# EAGLE design pstage (EAGLE 5.06)
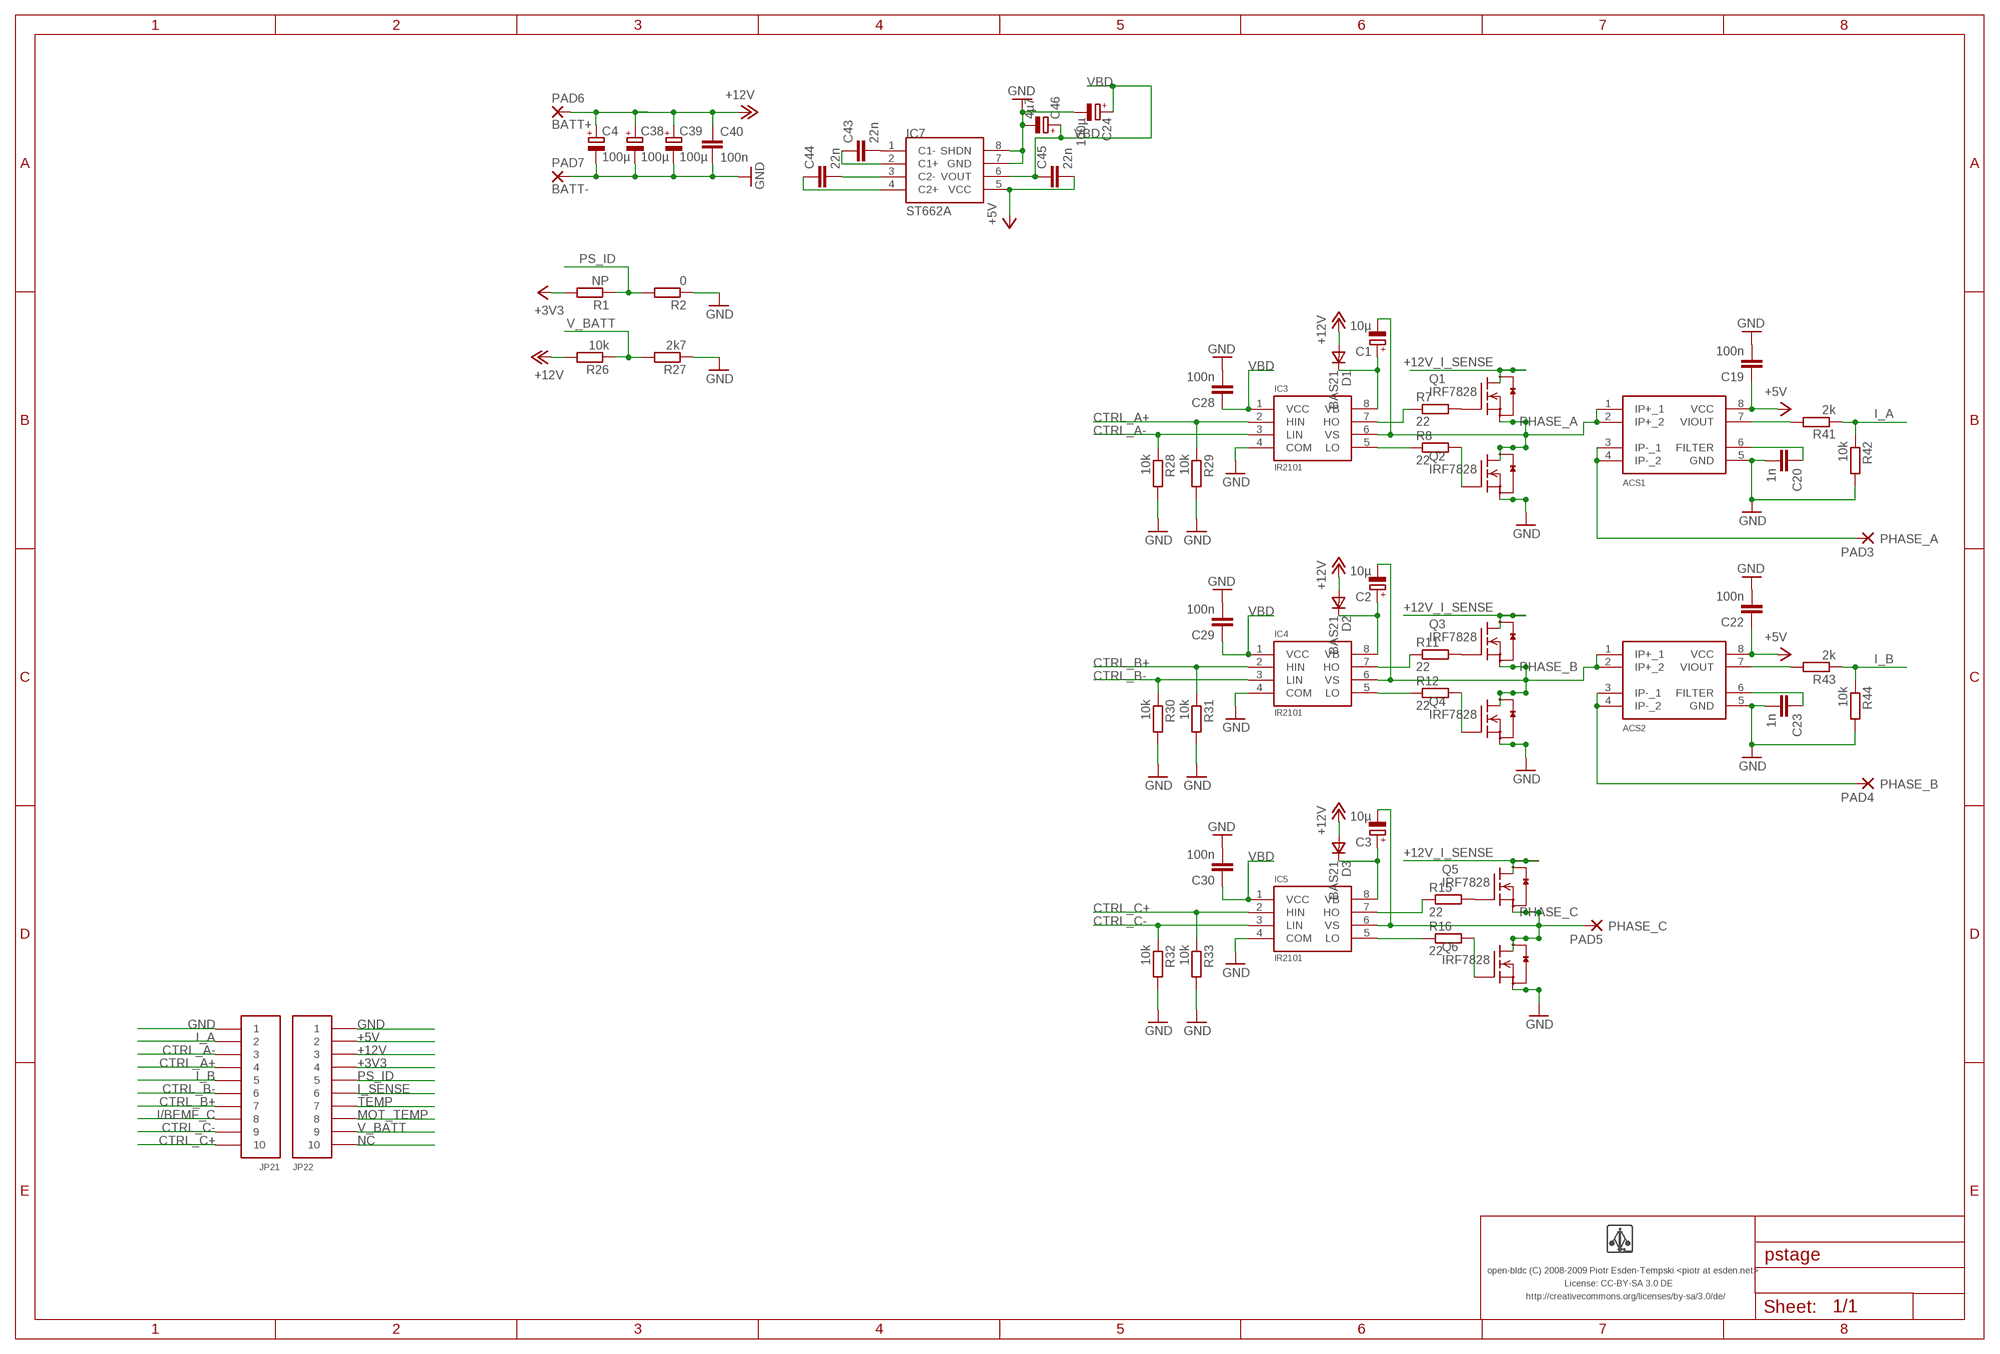
[diagram p0: schematic, sheet 1]

## Parts
ACS1  ACS712  [SO8]
ACS2  ACS712  [SO8]
C1  10µ  CPOL-EUA/3216-18R  [A/3216-18R]
C2  10µ  CPOL-EUA/3216-18R  [A/3216-18R]
C3  10µ  CPOL-EUA/3216-18R  [A/3216-18R]
C4  100µ  CPOL-EUD/7343-31R  [D/7343-31R]
C19  100n  C-EUC0603  [C0603]
C20  1n  C-EUC0603  [C0603]
C22  100n  C-EUC0603  [C0603]
C23  1n  C-EUC0603  [C0603]
C24  100µ  CPOL-EUD/7343-31R  [D/7343-31R]
C28  100n  C-EUC0603  [C0603]
C29  100n  C-EUC0603  [C0603]
C30  100n  C-EUC0603  [C0603]
C38  100µ  CPOL-EUD/7343-31R  [D/7343-31R]
C39  100µ  CPOL-EUD/7343-31R  [D/7343-31R]
C40  100n  C-EUC0603  [C0603]
C43  22n  C-EUC0603  [C0603]
C44  22n  C-EUC0603  [C0603]
C45  22n  C-EUC0603  [C0603]
C46  4µ7  CPOL-EUA/3216-18R  [A/3216-18R]
D1  BAS21  VAR2SOT23  [SOT-23]
D2  BAS21  VAR2SOT23  [SOT-23]
D3  BAS21  VAR2SOT23  [SOT-23]
IC3  IR2101  [SO-8]
IC4  IR2101  [SO-8]
IC5  IR2101  [SO-8]
IC7  ST662A  [SO8]
JP21  PIN_HDR_1.27MM_10  PIN_HDR_1.27MM_10_TH  [PIN_HDR_1.27MM_10]
JP22  PIN_HDR_1.27MM_10  PIN_HDR_1.27MM_10_TH  [PIN_HDR_1.27MM_10]
PAD3  PHASE_A  SMD5  [SMD2,54-5,08]
PAD4  PHASE_B  SMD5  [SMD2,54-5,08]
PAD5  PHASE_C  SMD5  [SMD2,54-5,08]
PAD6  BATT+  SMD5  [SMD2,54-5,08]
PAD7  BATT-  SMD5  [SMD2,54-5,08]
Q1  IRF7828  [SO8]
Q2  IRF7828  [SO8]
Q3  IRF7828  [SO8]
Q4  IRF7828  [SO8]
Q5  IRF7828  [SO8]
Q6  IRF7828  [SO8]
R1  NP  R-EU_R0603  [R0603]
R2  0  R-EU_R0603  [R0603]
R7  22  R-EU_R0603  [R0603]
R8  22  R-EU_R0603  [R0603]
R11  22  R-EU_R0603  [R0603]
R12  22  R-EU_R0603  [R0603]
R15  22  R-EU_R0603  [R0603]
R16  22  R-EU_R0603  [R0603]
R26  10k  R-EU_R0603  [R0603]
R27  2k7  R-EU_R0603  [R0603]
R28  10k  R-EU_R0603  [R0603]
R29  10k  R-EU_R0603  [R0603]
R30  10k  R-EU_R0603  [R0603]
R31  10k  R-EU_R0603  [R0603]
R32  10k  R-EU_R0603  [R0603]
R33  10k  R-EU_R0603  [R0603]
R41  2k  R-EU_R0603  [R0603]
R42  10k  R-EU_R0603  [R0603]
R43  2k  R-EU_R0603  [R0603]
R44  10k  R-EU_R0603  [R0603]
U$1  LOGO  [LOGO]

## Nets
+3V3: JP22.P$4 R1.2
+5V: ACS1.8(VCC) ACS2.8(VCC) C19.1 C22.1 C45.2 IC7.5(VCC) JP22.P$2
+12V: C4.+ C38.+ C39.+ C40.1 D1.3(A) D2.3(A) D3.3(A) JP22.P$3 PAD6.1(P) R26.2
+12V_I_SENSE: Q1.5(D1) Q1.6(D2) Q1.7(D3) Q1.8(D4) Q3.5(D1) Q3.6(D2) Q3.7(D3) Q3.8(D4) Q5.5(D1) Q5.6(D2) Q5.7(D3) Q5.8(D4)
CTRL_A+: IC3.2(HIN) JP21.P$4 R29.1
CTRL_A-: IC3.3(LIN) JP21.P$3 R28.1
CTRL_B+: IC4.2(HIN) JP21.P$7 R31.1
CTRL_B-: IC4.3(LIN) JP21.P$6 R30.1
CTRL_C+: IC5.2(HIN) JP21.P$10 R33.1
CTRL_C-: IC5.3(LIN) JP21.P$9 R32.1
GND: ACS1.5(GND) ACS2.5(GND) C4.- C19.2 C20.2 C22.2 C23.2 C24.- C28.2 C29.2 C30.2 C38.- C39.- C40.2 C46.- IC3.4(COM) IC4.4(COM) IC5.4(COM) IC7.7(GND) IC7.8(SHDN) JP21.P$1 JP22.P$1 PAD7.1(P) Q2.1(S3) Q2.2(S2) Q2.3(S1) Q4.1(S3) Q4.2(S2) Q4.3(S1) Q6.1(S3) Q6.2(S2) Q6.3(S1) R2.1 R27.1 R28.2 R29.2 R30.2 R31.2 R32.2 R33.2 R42.2 R44.2
I/BEMF_C: JP21.P$8
I_A: JP21.P$2 R41.1 R42.1
I_B: JP21.P$5 R43.1 R44.1
I_PHASE_A: ACS1.3(IP-_1) ACS1.4(IP-_2) PAD3.1(P)
I_PHASE_B: ACS2.3(IP-_1) ACS2.4(IP-_2) PAD4.1(P)
I_SENSE: JP22.P$6
MOT_TEMP: JP22.P$8
N$1: IC4.7(HO) R11.1
N$2: IC3.7(HO) R7.1
N$7: IC3.5(LO) R8.1
N$11: Q1.4(G) R7.2
N$12: C1.+ D1.1(C) IC3.8(VB)
N$13: IC4.5(LO) R12.1
N$14: Q5.4(G) R15.2
N$15: Q3.4(G) R11.2
N$16: C2.+ D2.1(C) IC4.8(VB)
N$17: Q4.4(G) R12.2
N$18: IC5.7(HO) R15.1
N$19: IC5.5(LO) R16.1
N$21: C3.+ D3.1(C) IC5.8(VB)
N$24: C43.2 IC7.1(C1-)
N$27: C44.2 IC7.3(C2-)
N$28: Q6.4(G) R16.2
N$29: C43.1 IC7.2(C1+)
N$30: C44.1 IC7.4(C2+)
N$31: ACS1.6(FILTER) C20.1
N$32: ACS1.7(VIOUT) R41.2
N$34: ACS2.6(FILTER) C23.1
N$35: ACS2.7(VIOUT) R43.2
N$43: Q2.4(G) R8.2
NC: JP22.P$10
PHASE_A: ACS1.1(IP+_1) ACS1.2(IP+_2) C1.- IC3.6(VS) Q1.1(S3) Q1.2(S2) Q1.3(S1) Q2.5(D1) Q2.6(D2) Q2.7(D3) Q2.8(D4)
PHASE_B: ACS2.1(IP+_1) ACS2.2(IP+_2) C2.- IC4.6(VS) Q3.1(S3) Q3.2(S2) Q3.3(S1) Q4.5(D1) Q4.6(D2) Q4.7(D3) Q4.8(D4)
PHASE_C: C3.- IC5.6(VS) PAD5.1(P) Q5.1(S3) Q5.2(S2) Q5.3(S1) Q6.5(D1) Q6.6(D2) Q6.7(D3) Q6.8(D4)
PS_ID: JP22.P$5 R1.1 R2.2
TEMP: JP22.P$7
V_BATT: JP22.P$9 R26.1 R27.2
VBD: C24.+ C28.1 C29.1 C30.1 C45.1 C46.+ IC3.1(VCC) IC4.1(VCC) IC5.1(VCC) IC7.6(VOUT)

## Notes on the sheet
- open-bldc (C) 2008-2009 Piotr Esden-Tempski <piotr at esden.net>
- License: CC-BY-SA 3.0 DE
- http://creativecommons.org/licenses/by-sa/3.0/de/

## Library data of the parts
ACS1 ACS2 = open-bldc:ACS712
C1-C4 C24 C38 C39 C46 = rcl:CPOL-EU: POLARIZED CAPACITOR, European symbol
C19 C20 C22 C23 C28-C30 C40 C43-C45 = rcl:C-EU: CAPACITOR, European symbol
D1-D3 = zetex:VAR2SOT23: DIODE
IC3-IC5 = open-bldc:IR2101
IC7 = open-bldc:ST662A
JP21 JP22 = open-bldc:PIN_HDR_1.27MM_10
PAD3-PAD7 = wirepad:SMD5: SMD PAD
Q1-Q6 = open-bldc:IRF7828
R1 R2 R7 R8 R11 R12 R15 R16 R26-R33 R41-R44 = rcl:R-EU_: RESISTOR, European symbol
U$1 = open-bldc:LOGO

## Board
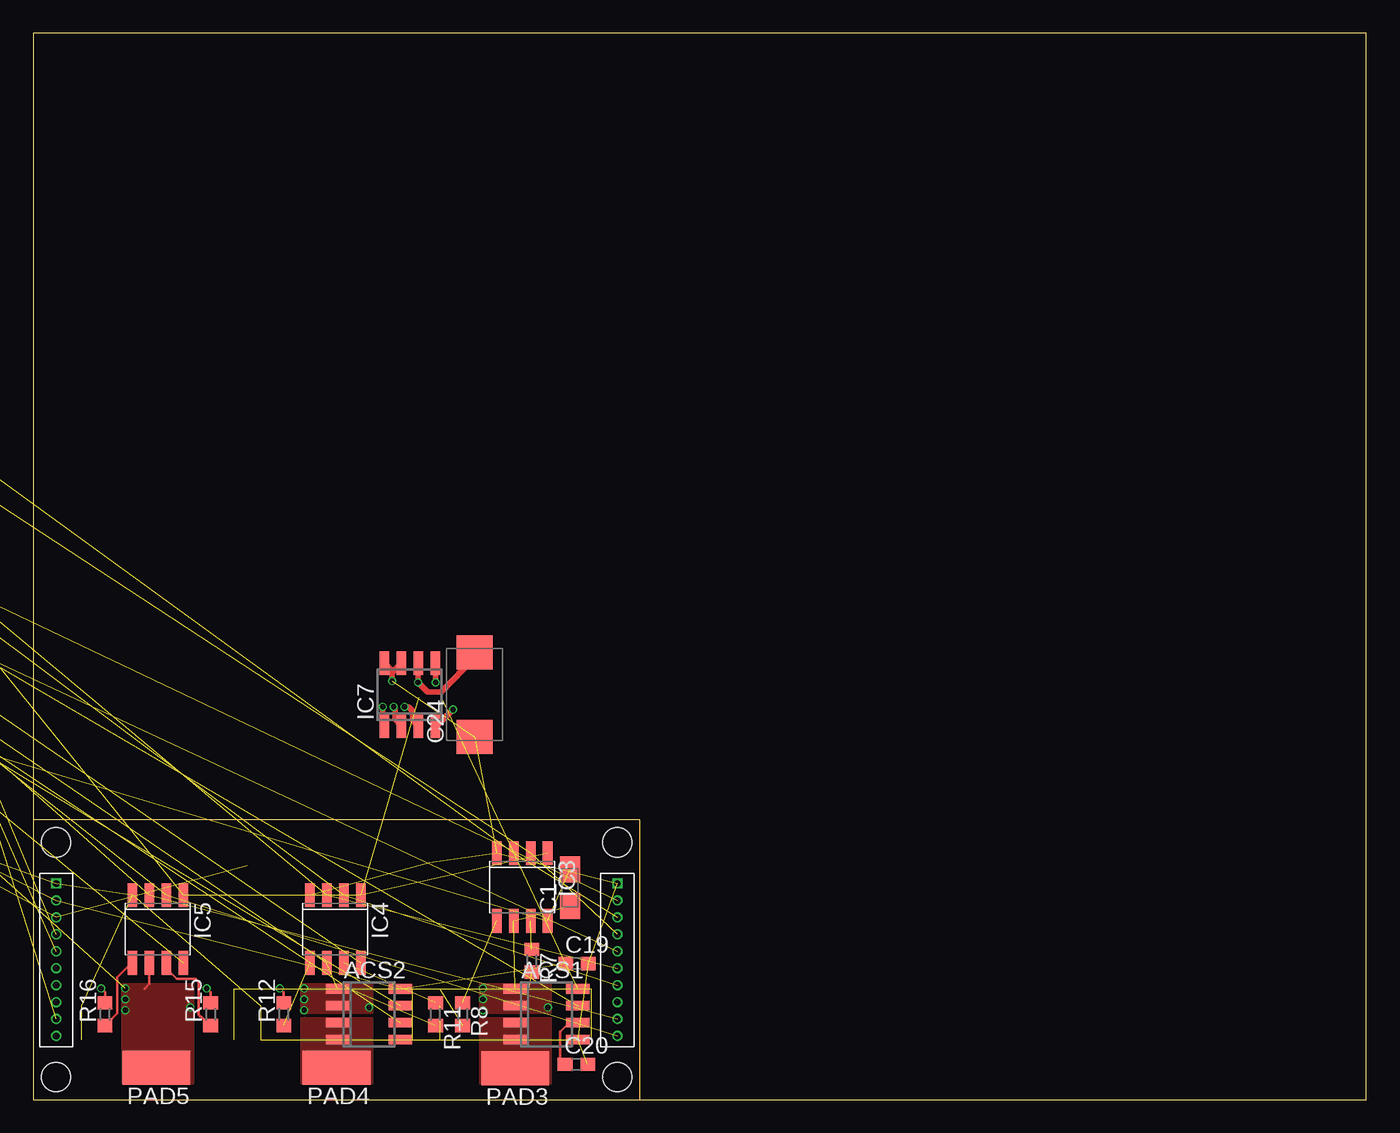
[diagram p1: board, top side]
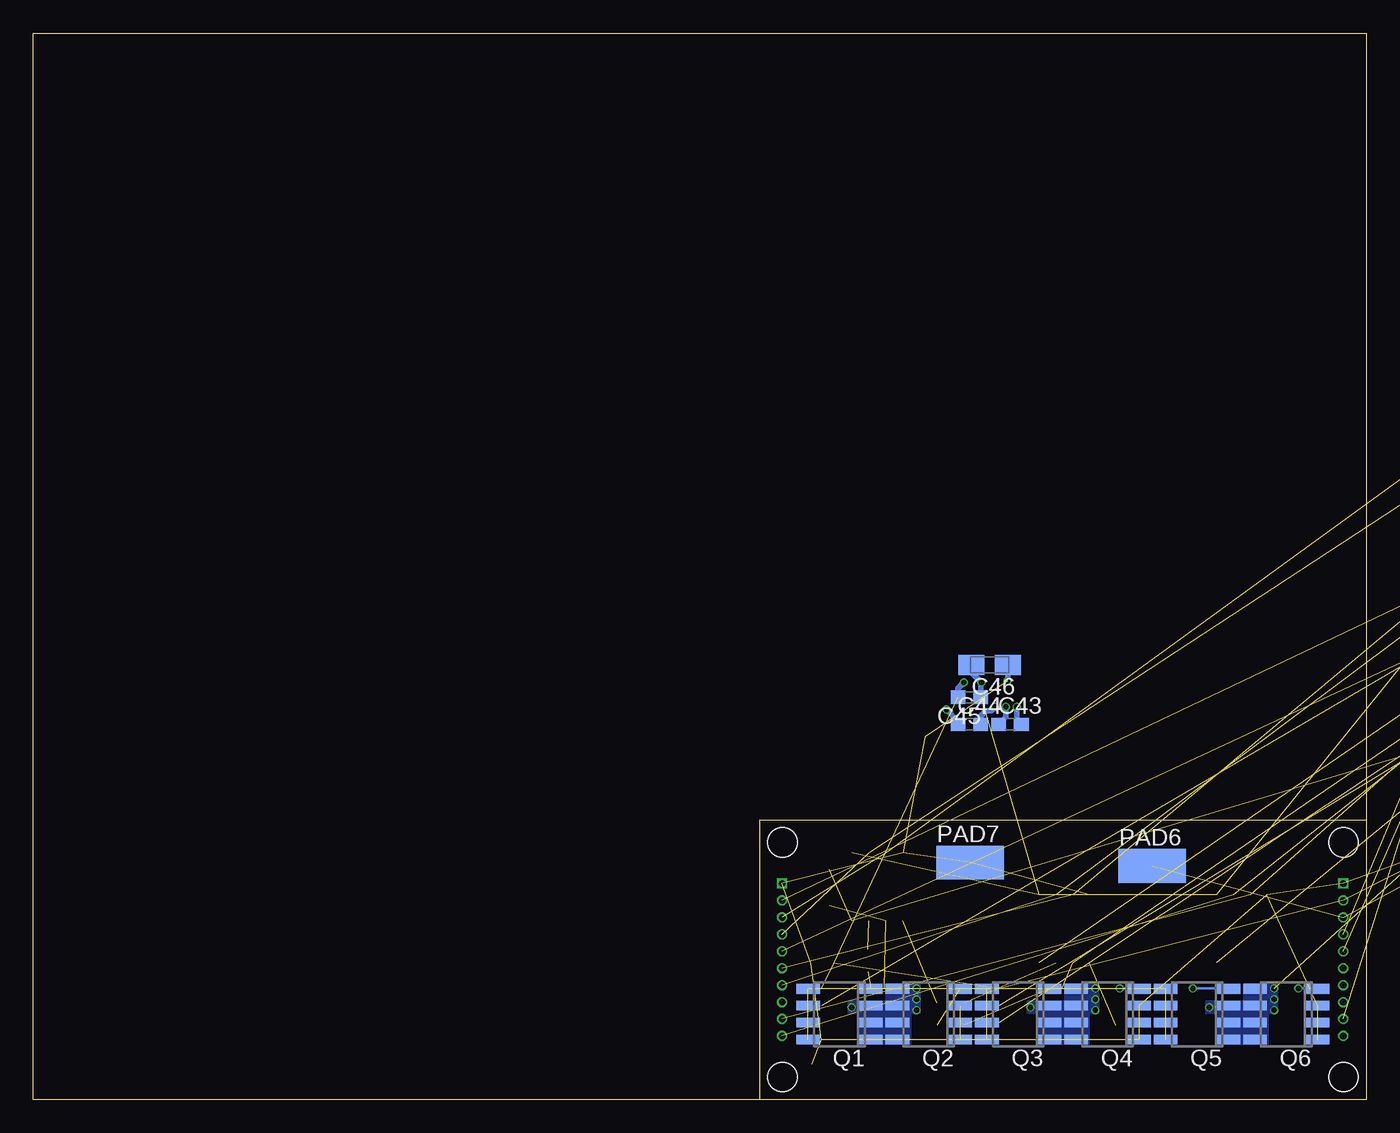
[diagram p2: board, bottom side, seen from below]

Size 100 x 80 mm. Coordinates in mm from the lower left corner, seen from the top.
Outline: 0,0 100,0 100,80 0,80 0,0
Outline: 0,0 45.5,0 45.5,21 0,21 0,0
Copper layers (1*16): Top 0.035mm / dielectric 1.5mm / Bottom 0.035mm
Design rules "default *": minimum track width 8mil, minimum drill 0.4mm, track to track 8mil, track to pad 8mil, pad to pad 8mil, via to via 8mil, smd to smd 8mil, copper to edge 40mil, drill to drill 8mil, minimum pad ring 0.1mm, minimum via ring 0.1mm, stop-mask expansion 4mil, vias tented up to drill 0mil, thermal gap 10mil
Holes 2.2 mm at 1.7,1.7 43.8,1.7 43.8,19.3 1.7,19.3

### Footprints (pad centres in the part's own frame; a part is rotated, then mirrored left to right if it is on the bottom)
SO8 = smd 0.72 x 1.78: 1 -1.905,-2.35; 2 -0.635,-2.35; 3 0.635,-2.35; 4 1.905,-2.35; 5 1.905,2.35; 6 0.635,2.35; 7 -0.635,2.35; 8 -1.905,2.35
A/3216-18R = smd 1.95 x 1.5: + 1.375,0; - -1.375,0
D/7343-31R = smd 2.55 x 2.7: + 3.175,0; - -3.175,0
C0603 = smd 1.1 x 1: 1 -0.85,0; 2 0.85,0
SOT-23 = smd 0.787 x 0.889: 1 0.025,-1.016; 2 -0.94,1.016; 3 0.991,1.016
SO-8 = smd 0.72 x 1.78: 1 -1.905,-2.543; 2 -0.635,-2.543; 3 0.635,-2.543; 4 1.905,-2.543; 5 1.905,2.543; 6 0.635,2.543; 7 -0.635,2.543; 8 -1.905,2.543
PIN_HDR_1.27MM_10 = drill 0.5 square: P$1 0,0 | drill 0.5 round: P$2 0,1.27; P$3 0,2.54; P$4 0,3.81; P$5 0,5.08; P$6 0,6.35; P$7 0,7.62; P$8 0,8.89; P$9 0,10.16; P$10 0,11.43
SMD2,54-5,08 = smd 2.54 x 5.08: 1 0,0
R0603 = smd 1 x 1.1: 1 -0.85,0; 2 0.85,0

### Placement (x,y rotation side)
ACS1  38.51,6.4 270 top
ACS2  25.2,6.4 270 top
C1  40.28,15.9 90 top
C2  -26.67,44.45 0 top  (outside the outline)
C3  -31.75,44.45 0 top  (outside the outline)
C4  -63.5,19.05 0 top  (outside the outline)
C19  40.79,10.21 0 top
C20  40.74,2.64 0 top
C22  -55.88,44.45 0 top  (outside the outline)
C23  -39.37,50.8 0 top  (outside the outline)
C24  33.12,30.38 90 top
C28  -62.23,44.45 0 top  (outside the outline)
C29  -16.51,50.8 0 top  (outside the outline)
C30  -22.86,50.8 0 top  (outside the outline)
C38  -27.94,27.94 0 top  (outside the outline)
C39  -38.1,27.94 0 top  (outside the outline)
C40  -29.21,50.8 0 top  (outside the outline)
C43  26.72,28.14 0 bottom
C44  29.77,28.14 0 bottom
C45  29.77,30.18 180 bottom
C46  28.24,32.61 180 bottom
D1  -27.94,34.29 0 top  (outside the outline)
D2  -35.56,34.29 0 top  (outside the outline)
D3  -43.18,34.29 0 top  (outside the outline)
IC3  36.68,15.95 180 top
IC4  22.66,12.8 180 top
IC5  9.35,12.8 180 top
IC7  28.24,30.38 0 top
JP21  43.82,16.2 180 top
JP22  1.72,16.2 180 top
PAD3  36.17,2.34 90 top
PAD4  22.76,2.39 90 top
PAD5  9.25,2.39 90 top
PAD6  16.05,17.53 270 bottom
PAD7  29.72,17.78 270 bottom
Q1  39.52,6.4 90 bottom
Q2  32.82,6.4 90 bottom
Q3  26.11,6.4 90 bottom
Q4  19.41,6.4 90 bottom
Q5  12.7,6.4 90 bottom
Q6  5.99,6.4 90 bottom
R1  -21.59,66.04 0 top  (outside the outline)
R2  -25.4,66.04 0 top  (outside the outline)
R7  37.39,10.41 270 top
R8  32.21,6.4 270 top
R11  30.18,6.4 270 top
R12  18.8,6.4 90 top
R15  13.31,6.4 90 top
R16  5.38,6.4 90 top
R26  -67.31,55.88 0 top  (outside the outline)
R27  -16.51,60.96 0 top  (outside the outline)
R28  -21.59,60.96 0 top  (outside the outline)
R29  -26.67,60.96 0 top  (outside the outline)
R30  -31.75,60.96 0 top  (outside the outline)
R31  -36.83,60.96 0 top  (outside the outline)
R32  -41.91,60.96 0 top  (outside the outline)
R33  -46.99,60.96 0 top  (outside the outline)
R41  -52.07,60.96 0 top  (outside the outline)
R42  -57.15,60.96 0 top  (outside the outline)
R43  -62.23,60.96 0 top  (outside the outline)
R44  -67.31,60.96 0 top  (outside the outline)
U$1  -54.61,64.77 0 top  (outside the outline)

### Tracks (layer width: path | path; a pad name or v marks a point on that pad's centre or on a via)
+3V3  (1 unrouted)
+5V  (via drill 0.4)  (5 unrouted)
  Top 0.406: v30.18,31.29 30.18,32.7 IC7.5
  Bottom 0.406: C45.2 30.62,30.85 v30.18,31.29
+12V  (9 unrouted)
+12V_I_SENSE  (11 unrouted)
CTRL_A+  (2 unrouted)
CTRL_A-  (2 unrouted)
CTRL_B+  (2 unrouted)
CTRL_B-  (2 unrouted)
CTRL_C+  (2 unrouted)
CTRL_C-  (2 unrouted)
GND  (via drill 0.4)  (39 unrouted)
  Top 0.406: 26.92,31.9 26.92,32.14 IC7.8 | 26.92,31.9 v26.92,31.39 | IC7.7 26.92,32.04 26.92,31.9
  Bottom 0.406: C46.- 26.87,31.45 v26.92,31.39
I_A  (2 unrouted)
I_B  (2 unrouted)
I_PHASE_A
  pour Top (no thermals): 33.53,1.22 33.53,6.1 38.81,6.1 38.81,1.22
I_PHASE_B
  pour Top (no thermals): 20.12,1.22 20.12,6.1 25.4,6.1 25.4,1.22
N$1  (1 unrouted)
N$2  (1 unrouted)
N$7  (1 unrouted)
N$11  (1 unrouted)
N$12  (2 unrouted)
N$13  (1 unrouted)
N$14  (via drill 0.4)
  Top 0.203: R15.2 13.31,8.03 v13.01,8.33
  Bottom 0.203: v13.01,8.33 10.38,8.33 Q5.4
N$15  (1 unrouted)
N$16  (2 unrouted)
N$17  (via drill 0.4)
  Top 0.203: R12.2 18.8,8.03 v18.49,8.33
  Bottom 0.203: v18.49,8.33 17.08,8.33 Q4.4
N$18
  Top 0.203: IC5.7 9.98,9.83 10.77,9.04 12.19,9.04 12.39,8.84 12.39,6.36 R15.1
N$19
  Top 0.203: R16.1 6.3,6.46 6.3,9.17 7.39,10.26 IC5.5
N$21  (2 unrouted)
N$24  (via drill 0.4)
  Top 0.406: IC7.1 26.21,28.16 v26.21,29.46
  Bottom 0.406: C43.2 26.21,28.48 v26.21,29.46
N$27  (via drill 0.4)
  Top 0.406: IC7.3 28.45,28.46 28.45,29.16 28.14,29.46 v27.84,29.46
  Bottom 0.406: C44.2 28.96,28.18 28.96,28.75 28.55,29.16 28.45,29.16 28.14,29.16 v27.84,29.46
N$28  (via drill 0.4)
  Top 0.203: R16.2 5.38,8.03 v5.08,8.33
  Bottom 0.203: v5.08,8.33 3.67,8.33 Q6.4
N$29  (via drill 0.4)
  Top 0.406: IC7.2 27.13,28.51 27.13,28.96 27.13,29.36 v27.03,29.46
  Bottom 0.406: C43.1 27.03,28.69 v27.03,29.46
N$30  (via drill 0.4)
  Top 0.406: IC7.4 30.26,28.03 v31.5,29.26
  Bottom 0.406: v31.5,29.26 30.62,28.38 C44.1
N$31
  Top 0.203: C20.1 39.52,3.01 39.52,5.08 40.21,5.77 ACS1.6
N$32  (1 unrouted)
N$34  (1 unrouted)
N$35  (1 unrouted)
N$43  (1 unrouted)
PHASE_A  (via drill 0.4)  (2 unrouted)
  other vias: 33.73,8.33 33.73,7.52 33.73,6.71 38.61,6.91
  pour Bottom (no thermals): 35.97,8.64 33.53,8.64 33.53,6.5 34.24,6.5 34.24,4.17 38.1,4.17 38.1,6.5 38.81,6.5 38.81,7.32 35.97,7.32
  pour Top (no thermals): 33.53,8.64 38.81,8.64 38.81,6.5 33.53,6.5
PHASE_B  (via drill 0.4)  (2 unrouted)
  other vias: 20.32,8.33 20.32,7.52 20.32,6.71 25.2,6.91
  pour Bottom (no thermals): 22.56,8.64 20.12,8.64 20.12,6.5 20.83,6.5 20.83,4.17 24.69,4.17 24.69,6.5 25.4,6.5 25.4,7.32 22.56,7.32
  pour Top (no thermals): 20.12,8.64 25.4,8.64 25.4,6.5 20.12,6.5
PHASE_C  (via drill 0.4)  (1 unrouted)
  Top 0.203: IC5.6 8.71,8.67 Q6.5
  other vias: 6.91,8.33 6.91,7.52 6.91,6.71 11.79,6.91
  pour Top (no thermals): 6.71,8.64 11.99,8.64 11.99,1.22 6.71,1.22
  pour Bottom (no thermals): 9.14,8.64 6.71,8.64 6.71,6.5 7.42,6.5 7.42,4.17 11.28,4.17 11.28,6.5 11.99,6.5 11.99,7.32 9.14,7.32
PS_ID  (2 unrouted)
V_BATT  (2 unrouted)
VBD  (via drill 0.4)  (6 unrouted)
  Top 0.406: v28.85,31.29 28.85,32.7 IC7.6 | v28.85,31.29 28.85,31.27 | C24.+ 33.12,33.12 30.58,30.58 29.57,30.58 v28.85,31.29
  Bottom 0.406: C45.1 28.92,31.23 v28.85,31.29 29.62,32.06 C46.+